# EAGLE design BrightButton (EAGLE 6.5.0)
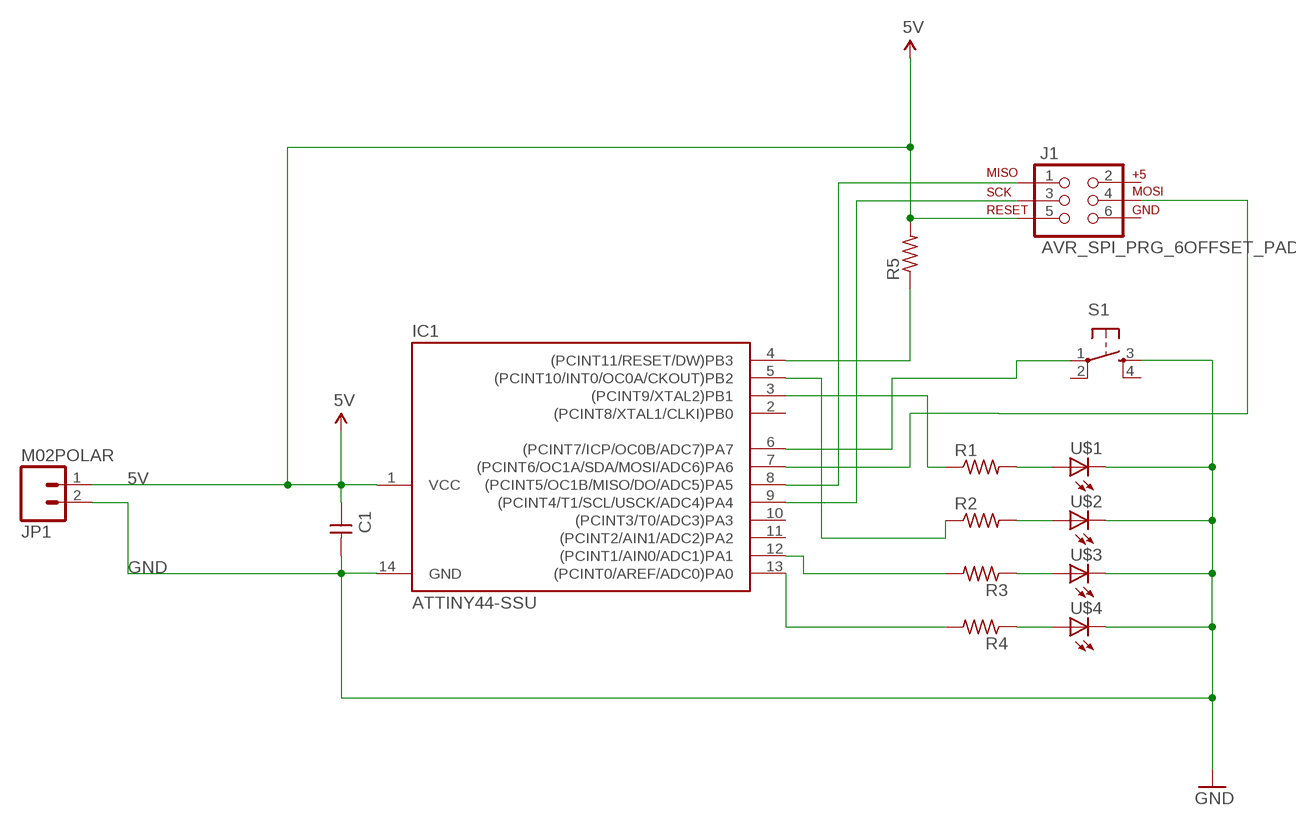
[diagram p0: schematic, sheet 1]

## Parts
C1  UNPOLARIZED_CAPACITOR1206  [1206]
IC1  ATTINY44-SSU  [SOIC14]
J1  AVR_SPI_PRG_6OFFSET_PADS  [2X3_OFFSET]
JP1  M02POLAR  [MOLEX-1X2]
R1  RESISTOR1206  [1206]
R2  RESISTOR1206  [1206]
R3  RESISTOR1206  [1206]
R4  RESISTOR1206  [1206]
R5  RESISTOR1206  [1206]
S1  6MM_SWITCH6MM_SWITCH  [6MM_SWITCH]
U$1  LED1206  [1206]
U$2  LED1206  [1206]
U$3  LED1206  [1206]
U$4  LED1206  [1206]

## Nets
5V: C1.1 IC1.1(VCC) J1.5 JP1.1 R5.2
GND: C1.2 IC1.14(GND) JP1.2 S1.3(S) U$1.2(C) U$2.2(C) U$3.2(C) U$4.2(C)
N$1: R3.1 U$3.1(A)
N$2: IC1.12((PCINT1/AIN0/ADC1)PA1) R3.2
N$3: R2.2 U$2.1(A)
N$4: R4.1 U$4.1(A)
N$5: R1.2 U$1.1(A)
N$6: IC1.5((PCINT10/INT0/OC0A/CKOUT)PB2) R2.1
N$7: IC1.3((PCINT9/XTAL2)PB1) R1.1
N$8: IC1.13((PCINT0/AREF/ADC0)PA0) R4.2
N$9: IC1.4((PCINT11/RESET/DW)PB3) R5.1
N$10: IC1.8((PCINT5/OC1B/MISO/DO/ADC5)PA5) J1.1
N$11: IC1.9((PCINT4/T1/SCL/USCK/ADC4)PA4) J1.3
N$12: IC1.7((PCINT6/OC1A/SDA/MOSI/ADC6)PA6) J1.4
N$13: IC1.6((PCINT7/ICP/OC0B/ADC7)PA7) S1.1(P)
Unconnected: IC1.2((PCINT8/XTAL1/CLKI)PB0) IC1.10((PCINT3/T0/ADC3)PA3) IC1.11((PCINT2/AIN1/ADC2)PA2) J1.2 J1.6 S1.2(P1) S1.4(S1)

## Library data of the parts
C1 = FAB_Hello:UNPOLARIZED_CAPACITOR: unpolarized_capacitor
IC1 = FAB_Hello:ATTINY44
J1 = SparkFun-Connectors:AVR_SPI_PRG_6: AVR ISP 6 Pin This is the reduced ISP connector for AVR programming. Common on Arduino. This footprint will take up less PCB space and can be used with a 10-pin to 6-pin adapter such as SKU: BOB-08508
JP1 = SparkFun-Connectors:M02: Standard 2-pin 0.1" header. Use with - straight break away headers ( PRT-00116) - right angle break away headers (PRT-00553) - swiss pins (PRT-00743) - machine pins (PRT-00117) - female headers (PRT-00115) Molex polarized connector foot print use with: PRT-08233 with associated crimp pins and housings. 2.54_SCREWTERM for use with PRT-10571. 3.5mm Screw Terminal footprints for PRT-08084 5mm Screw Terminal footprints for use with PRT-08433
R1-R5 = FAB_Hello:RESISTOR
S1 = FAB_Hello:6MM_SWITCH: OMRON SWITCH
U$1-U$4 = FAB_Hello:LED

## Board
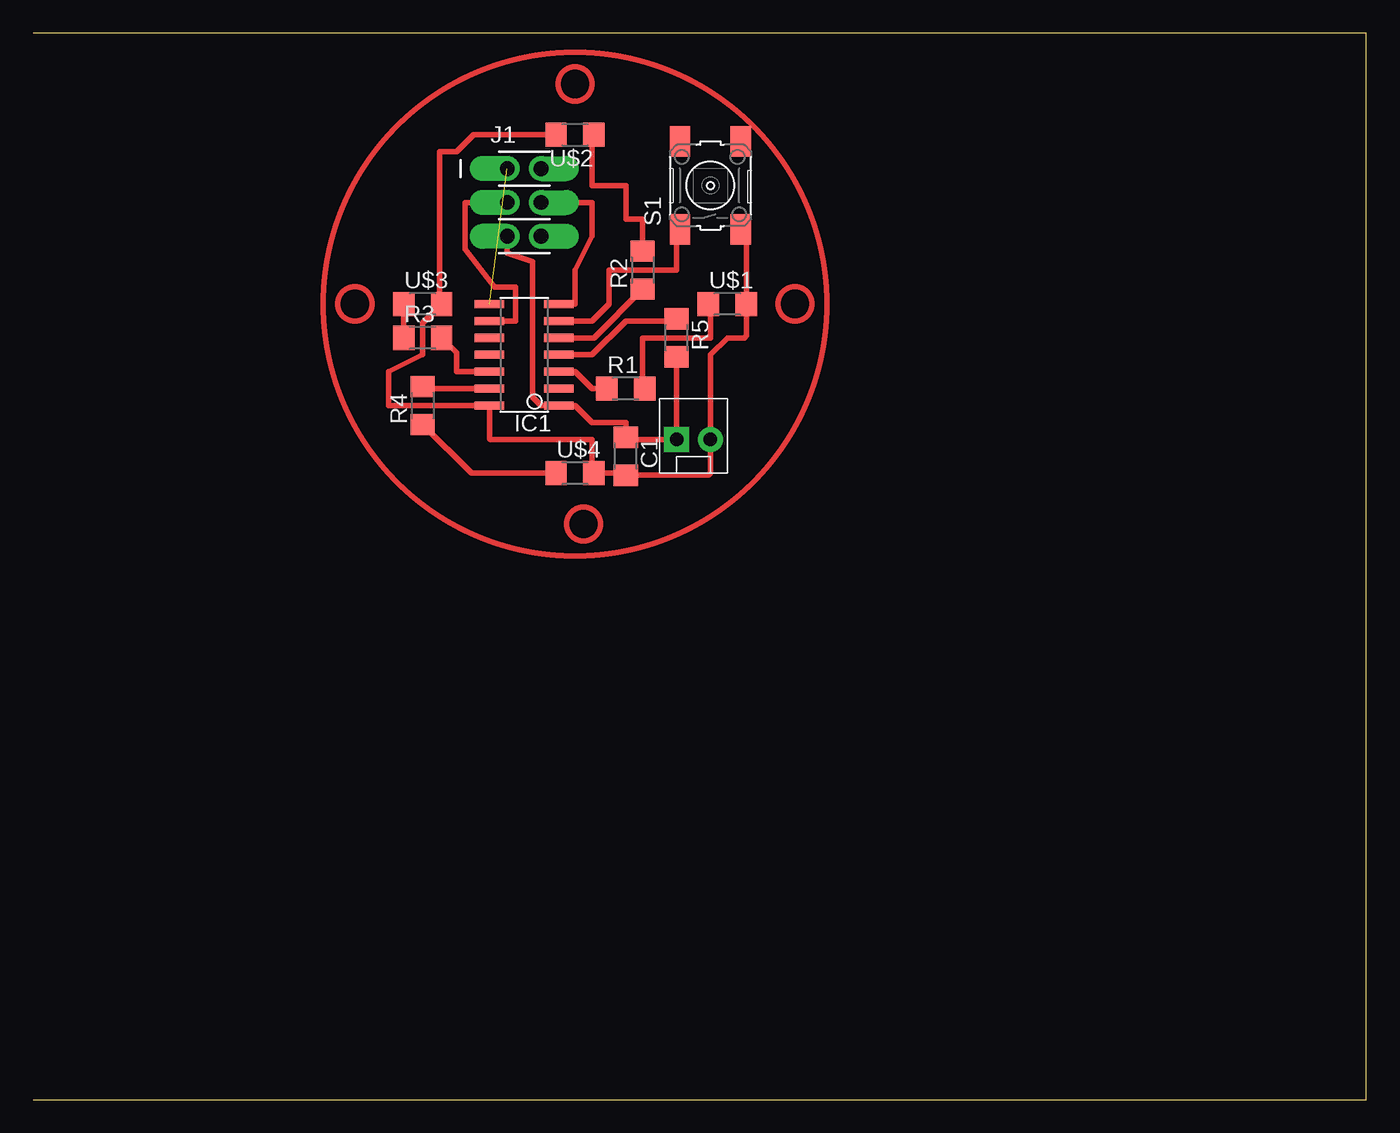
[diagram p1: board, top side]

Size 100 x 80 mm. Coordinates in mm from the lower left corner, seen from the top.
Outline: 0,0 100,0 100,80 0,80
Copper layers (1*16): Top 0.035mm / dielectric 1.5mm / Bottom 0.035mm
Design rules "default *": minimum track width 16mil, minimum drill 24mil, track to track 16mil, track to pad 16mil, pad to pad 16mil, via to via 16mil, smd to smd 16mil, copper to edge 40mil, drill to drill 16mil, minimum pad ring 10mil, minimum via ring 8mil, stop-mask expansion 4mil, vias tented up to drill 0mil, thermal gap 10mil

### Footprints (pad centres in the part's own frame; a part is rotated, then mirrored left to right if it is on the bottom)
1206 = smd 1.6 x 1.803: 1 -1.422,0; 2 1.422,0
SOIC14 = smd 0.61 x 2.21: 1 -3.81,-2.603; 2 -2.54,-2.603; 3 -1.27,-2.603; 4 0,-2.603; 5 1.27,-2.603; 6 2.54,-2.603; 7 3.81,-2.603; 8 3.81,2.603; 9 2.54,2.603; 10 1.27,2.603; 11 0,2.603; 12 -1.27,2.603; 13 -2.54,2.603; 14 -3.81,2.603
2X3_OFFSET = drill 1.118 pad 1.88 offset: 1 -2.54,-1.27; 2 -2.54,1.27; 3 0,-1.27; 4 0,1.27; 5 2.54,-1.27; 6 2.54,1.27
MOLEX-1X2 = drill 1.016 pad 1.88 square: 1 0,0 | drill 1.016 pad 1.88: 2 2.54,0
6MM_SWITCH = smd 2.286 x 1.524: 1 -3.302,2.286; 2 3.302,2.286; 3 -3.302,-2.286; 4 3.302,-2.286

### Placement (x,y rotation side)
C1  44.45,48.26 270 top
IC1  36.83,55.88 90 top
J1  36.83,67.31 270 top
JP1  48.26,49.53 0 top
R1  44.45,53.34 0 top
R2  45.72,62.23 90 top
R3  29.21,57.15 0 top
R4  29.21,52.07 90 top
R5  48.26,57.15 270 top
S1  50.8,68.58 90 top
U$1  52.07,59.69 0 top
U$2  40.64,72.39 180 top
U$3  29.21,59.69 0 top
U$4  40.64,46.99 0 top

### Tracks (layer width: path | path; a pad name or v marks a point on that pad's centre or on a via)
5V
  Top 0.406: R5.2 JP1.1 44.6,49.53 C1.1 44.45,50.8 41.91,50.8 40.64,52.07 IC1.1 38.1,52.07 37.47,52.7 37.47,62.87 35.56,63.5 J1.5
GND
  Top 0.406: S1.3 53.49,64.87 U$1.2 53.49,57.3 53.34,57.15 52.07,57.15 50.8,55.88 JP1.2 50.8,46.99 50.65,46.84 C1.2 44.45,46.99 U$4.2 41.91,47.14 41.91,49.53 34.29,49.53 34.23,49.59 IC1.14 | IC1.14 26.67,52.07 26.67,54.61 29.21,55.88 29.21,58.27 U$3.2 30.48,59.69 30.48,71.12 31.75,71.12 33.02,72.39 U$2.2 | IC1.14 34.29,52.07
N$1
  Top 0.406: U$3.1 R3.1
N$2
  Top 0.406: R3.2 31.75,56.03 31.75,54.61 IC1.12 34.29,54.61
N$3
  Top 0.406: 45.72,63.5 R2.2 45.72,66.04 44.45,66.04 44.45,68.58 41.91,68.58 41.91,72.39 U$2.1
N$4
  Top 0.406: R4.1 32.87,46.99 U$4.1
N$5
  Top 0.406: R1.2 45.72,53.49 45.72,57.15 50.8,57.15 50.8,59.69 U$1.1
N$6
  Top 0.406: IC1.5 42.06,57.15 R2.1
N$7
  Top 0.406: IC1.3 40.64,54.61 41.91,53.34 R1.1
N$8
  Top 0.406: R4.2 29.36,53.34 IC1.13
N$9
  Top 0.406: 39.37,55.88 IC1.4 41.91,55.88 44.45,58.42 48.26,58.42 R5.1
N$10  (1 unrouted)
N$11
  Top 0.406: J1.3 32.38,67.31 32.38,63.8 34.59,60.96 36.2,60.96 36.2,58.42 IC1.9
N$12
  Top 0.406: 39.37,59.69 IC1.7 40.64,59.69 40.64,62.23 41.91,64.77 41.91,67.31 J1.4
N$13
  Top 0.406: S1.1 48.26,65.02 48.26,62.23 43.18,62.23 43.18,59.69 41.91,58.42 IC1.6
(copper drawn outside any net)
  shapes: Top circle x5